# EAGLE schematic expo_conv_doc (EAGLE 6.5.0)
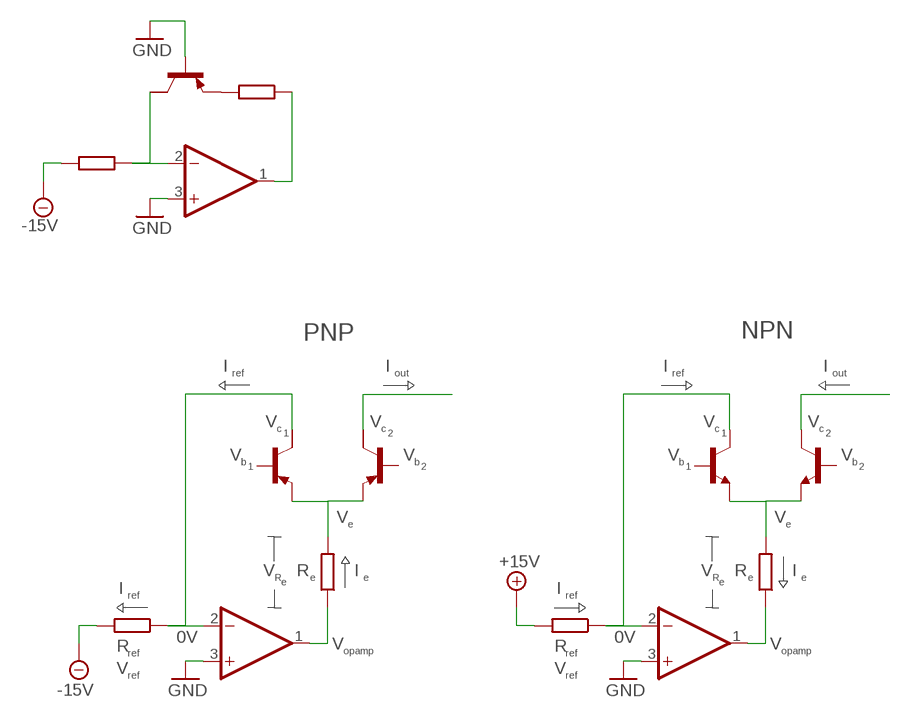
[diagram p0: schematic, sheet 1]

## Parts
IC1  TL072D  [SO08]
IC3  TL072D  [SO08]
IC4  TL072D  [SO08]
R1  R-EU_0204/2V  [0204V]
R2  R-EU_0204/2V  [0204V]
R5  R-EU_0204/2V  [0204V]
R6  R-EU_0204/2V  [0204V]
R7  R-EU_0204/2V  [0204V]
R8  R-EU_0204/2V  [0204V]
T1  PNP-TRANSISTIOR-2COLSOT89  [SOT89]
T2  PNP-TRANSISTIOR-2COLSOT89  [SOT89]
T3  -NPN-SOT23-EBC  [SOT23-EBC]
T4  -NPN-SOT23-EBC  [SOT23-EBC]
T5  PNP-TRANSISTIOR-2COLSOT89  [SOT89]

## Nets
+15V: R8.2
-15V: R2.2 R6.2
GND: IC1.3(A:+IN) IC3.3(A:+IN) IC4.3(A:+IN) T5.1(B)
N$1: R1.2 T1.3(E) T2.3(E)
N$2: IC1.1(A:OUT) R1.1
N$3: T2.2(C)
N$4: IC1.2(A:-IN) R2.1 T1.2(C)
N$9: R7.2 T3.E T4.E
N$10: IC3.1(A:OUT) R5.1
N$11: IC3.2(A:-IN) R6.1 T5.2(C)
N$12: R5.2 T5.3(E)
N$13: IC4.1(A:OUT) R7.1
N$14: T4.C
N$15: IC4.2(A:-IN) R8.1 T3.C
Unconnected: IC1.5(B:+IN) IC1.6(B:-IN) IC1.7(B:OUT) IC3.5(B:+IN) IC3.6(B:-IN) IC3.7(B:OUT) IC4.5(B:+IN) IC4.6(B:-IN) IC4.7(B:OUT) T1.1(B) T1.2@1(C/) T2.1(B) T2.2@1(C/) T3.B T4.B T5.2@1(C/)

## Notes on the sheet
- PNP | NPN
- I | I | I | I
- ref | out | ref | out
- V | V | V | V
- c | c | c | c
- 1 | 2 | 1 | 2
- V | V | V | V
- b | b | b | b
- 1 | 2 | 1 | 2
- V | V
- e | e
- V | R | I | V | R | I
- R | e | e | R | e | e
- e | e
- I | I
- ref | ref
- 0V | 0V
- R | V | R | V
- ref | opamp | ref | opamp
- V | V
- ref | ref

## Power pins joined to a net without a drawn wire
V+: IC1.8(P:V+) IC3.8(P:V+) IC4.8(P:V+)
V-: IC1.4(P:V-) IC3.4(P:V-) IC4.4(P:V-)

## Library data of the parts
IC1 IC3 IC4 = linear:TL072: OP AMP
R1 R2 R5-R8 = resistor:R-EU_: RESISTOR, European symbol
T1 T2 T5 = semicon-smd-ipc:PNP-TRANSISTIOR-2COL: PNP TRANSISTOR 2 colletor pins
T3 T4 = transistor:*-NPN-: NPN Transistror BF959 corrected 2008.03.06